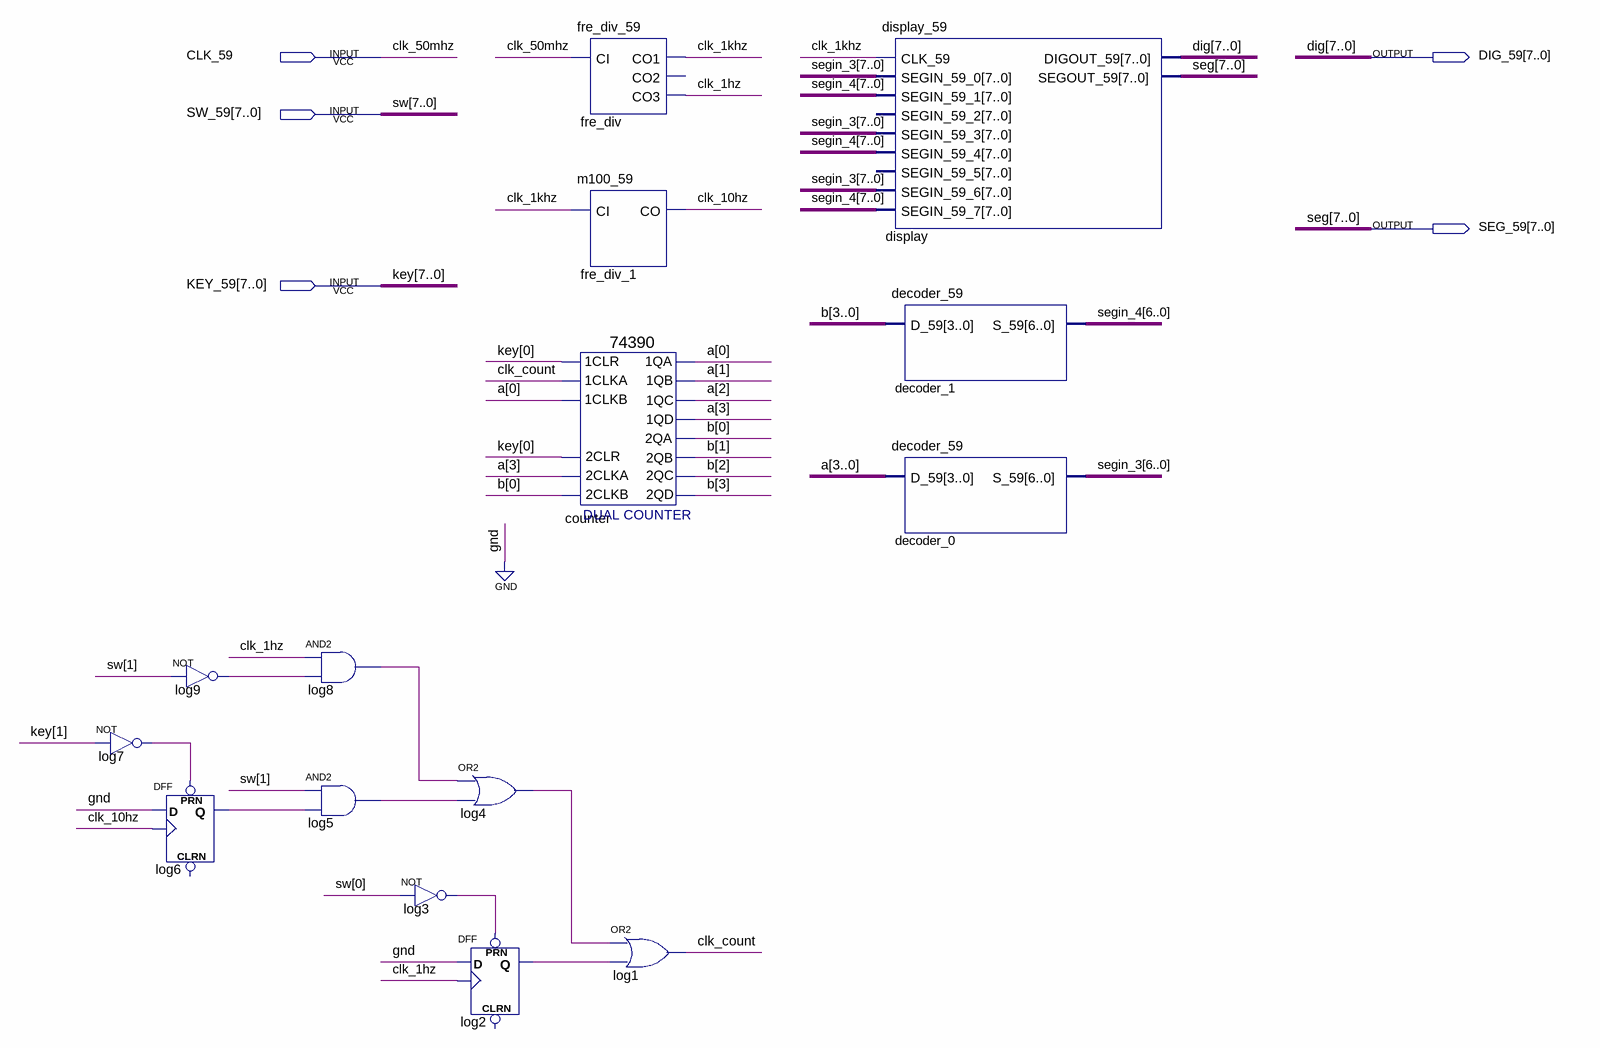
[diagram p0: schematic sheet]
// Quartus schematic dynamic_display_m100.bdf as structural Verilog: 15 symbols, 5 pins
module dynamic_display_m100 (
  input  CLK_59,
  input  [7:0] SW_59,
  input  [7:0] KEY_59,
  output [7:0] DIG_59,
  output [7:0] SEG_59
);

  wire clk_1hz, clk_1khz, clk_10hz, clk_count, log2_q, log3_out, log4_out, log5_out, log6_q, log7_out,
       log8_out, log9_out;
  wire [3:0] a, b;
  wire [7:0] segin_3, segin_4;

  not log7 (log7_out, KEY_59[1]);
  not log9 (log9_out, SW_59[1]);
  DFF log6 (.CLK(clk_10hz), .D(1'b0), .PRN(log7_out), .Q(log6_q));  // open: CLRN
  and log8 (log8_out, clk_1hz, log9_out);
  and log5 (log5_out, SW_59[1], log6_q);
  not log3 (log3_out, SW_59[0]);
  or log4 (log4_out, log8_out, log5_out);
  DFF log2 (.CLK(clk_1hz), .D(1'b0), .PRN(log3_out), .Q(log2_q));  // open: CLRN
  fre_div_59 fre_div (.CI(CLK_59), .CO1(clk_1khz), .CO3(clk_1hz));  // open: CO2
  m100_59 fre_div_1 (.CI(clk_1khz), .CO(clk_10hz));
  \74390  counter (
    .\2CLKA (a[3]), .\2CLR (KEY_59[0]), .\2CLKB (b[0]), .\1CLR (KEY_59[0]), .\1CLKA (clk_count),
    .\1CLKB (a[0]), .\1QA (a[0]), .\1QB (a[1]), .\1QC (a[2]), .\1QD (a[3]), .\2QA (b[0]), .\2QB (b[1]),
    .\2QC (b[2]), .\2QD (b[3]));
  or log1 (clk_count, log4_out, log2_q);
  display_59 display (
    .CLK_59(clk_1khz), .SEGIN_59_0(segin_3), .SEGIN_59_1(segin_4), .SEGIN_59_3(segin_3),
    .SEGIN_59_4(segin_4), .SEGIN_59_6(segin_3), .SEGIN_59_7(segin_4), .DIGOUT_59(DIG_59), .SEGOUT_59(SEG_59));  // open: SEGIN_59_2, SEGIN_59_5
  decoder_59 decoder_1 (.D_59(b), .S_59(segin_4[6:0]));
  decoder_59 decoder_0 (.D_59(a), .S_59(segin_3[6:0]));

  // Other names for the same wires on the sheet: clk_50mhz = CLK_59; dig[7:0] = DIG_59; key[7:0] = KEY_59;
  //   seg[7:0] = SEG_59; sw[7:0] = SW_59
endmodule
